# Altium schematic sheet DisplayPort_CON.SchDoc
size 420 x 297 mm; SheetNumber: 4; SheetTotal: 11; ModifiedBy: -; CheckedDate: -; Title2: Title 2; DivGrp: WUT ISE; Designer: G.Kasprowicz
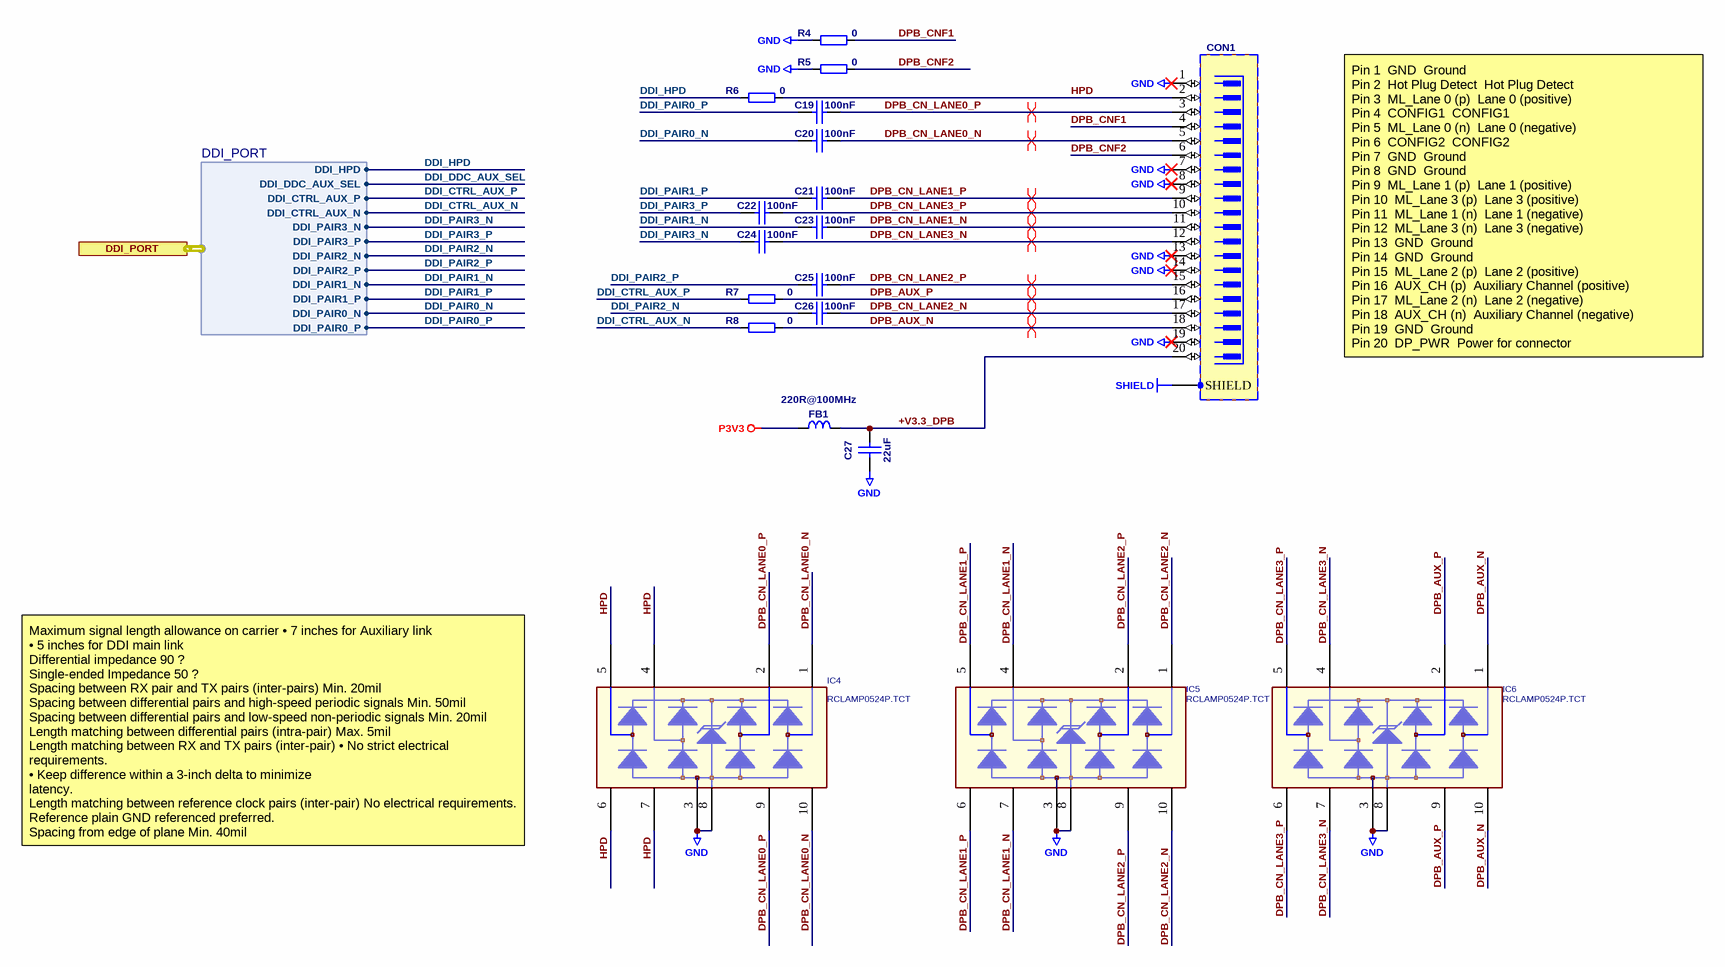
[diagram p0: DisplayPort_CON.SchDoc]

## Parts
C19  100nF  [CAPC1005X55N]
C20  100nF  [CAPC1005X55N]
C21  100nF  [CAPC1005X55N]
C22  100nF  [CAPC1005X55N]
C23  100nF  [CAPC1005X55N]
C24  100nF  [CAPC1005X55N]
C25  100nF  [CAPC1005X55N]
C26  100nF  [CAPC1005X55N]
C27  22uF  [CAPC2012X135N]
CON1  Mini DP  [MULTICOMP_64L020S-3x1N-B]  (value not drawn)
FB1  220R@100MHz  [0603L]
IC4  RCLAMP0524P.TCT  [SMDARRAYC_10P4C]
IC5  RCLAMP0524P.TCT  [SMDARRAYC_10P4C]
IC6  RCLAMP0524P.TCT  [SMDARRAYC_10P4C]
R4  0  [RESC1005X40N]
R5  0  [RESC1005X40N]
R6  0  [RESC1005X40N]
R7  0  [RESC1005X40N]
R8  0  [RESC1005X40N]

## Ports
DDI_PORT (harness DDI_PORT)

## Harnesses
DDI_PORT: DDI_PAIR0_P, DDI_PAIR0_N, DDI_PAIR1_P, DDI_PAIR1_N, DDI_PAIR2_P, DDI_PAIR2_N, DDI_CTRL_AUX_N, DDI_CTRL_AUX_P, DDI_DDC_AUX_SEL, DDI_HPD, DDI_PAIR3_P, DDI_PAIR3_N

## Nets
GND: C27.1 CON1.1 CON1.7 CON1.8 CON1.13 CON1.14 CON1.19 IC4.3 IC4.8 IC5.3 IC5.8 IC6.3 IC6.8 R4.1 R5.1
P3V3: FB1.1
SHIELD: CON1.SHIELD
+V3.3_DPB: C27.2 CON1.20 FB1.2
DDI_CTRL_AUX_N: R8.1 ; port DDI_PORT.DDI_CTRL_AUX_N
DDI_CTRL_AUX_P: R7.1 ; port DDI_PORT.DDI_CTRL_AUX_P
DDI_DDC_AUX_SEL: port DDI_PORT.DDI_DDC_AUX_SEL
DDI_HPD: R6.1 ; port DDI_PORT.DDI_HPD
DDI_PAIR0_N: C20.1 ; port DDI_PORT.DDI_PAIR0_N
DDI_PAIR0_P: C19.1 ; port DDI_PORT.DDI_PAIR0_P
DDI_PAIR1_N: C23.1 ; port DDI_PORT.DDI_PAIR1_N
DDI_PAIR1_P: C21.1 ; port DDI_PORT.DDI_PAIR1_P
DDI_PAIR2_N: C26.1 ; port DDI_PORT.DDI_PAIR2_N
DDI_PAIR2_P: C25.1 ; port DDI_PORT.DDI_PAIR2_P
DDI_PAIR3_N: C24.1 ; port DDI_PORT.DDI_PAIR3_N
DDI_PAIR3_P: C22.1 ; port DDI_PORT.DDI_PAIR3_P
DPB_AUX_N: CON1.18 IC6.1 IC6.10 R8.2
DPB_AUX_P: CON1.16 IC6.2 IC6.9 R7.2
DPB_CN_LANE0_N: C20.2 CON1.5 IC4.1 IC4.10
DPB_CN_LANE0_P: C19.2 CON1.3 IC4.2 IC4.9
DPB_CN_LANE1_N: C23.2 CON1.11 IC5.4 IC5.7
DPB_CN_LANE1_P: C21.2 CON1.9 IC5.5 IC5.6
DPB_CN_LANE2_N: C26.2 CON1.17 IC5.1 IC5.10
DPB_CN_LANE2_P: C25.2 CON1.15 IC5.2 IC5.9
DPB_CN_LANE3_N: C24.2 CON1.12 IC6.4 IC6.7
DPB_CN_LANE3_P: C22.2 CON1.10 IC6.5 IC6.6
DPB_CNF1: CON1.4 R4.2
DPB_CNF2: CON1.6 R5.2
HPD: CON1.2 IC4.4 IC4.5 IC4.6 IC4.7 R6.2

## Layout directives
differential pair: DPB_AUX_N, DPB_AUX_P, DPB_CN_LANE0_N, DPB_CN_LANE0_P, DPB_CN_LANE1_N, DPB_CN_LANE1_P, DPB_CN_LANE2_N, DPB_CN_LANE2_P, DPB_CN_LANE3_N, DPB_CN_LANE3_P

## Notes on the sheet
- Pin 1 	GND 	Ground
  Pin 2 	Hot Plug Detect 	Hot Plug Detect
  Pin 3 	ML_Lane 0 (p) 	Lane 0 (positive)
  Pin 4 	CONFIG1 	CONFIG1
  Pin 5 	ML_Lane 0 (n) 	Lane 0 (negative)
  Pin 6 	CONFIG2 	CONFIG2
  Pin 7 	GND 	Ground
  Pin 8 	GND 	Ground
  Pin 9 	ML_Lane 1 (p) 	Lane 1 (positive)
  Pin 10 	ML_Lane 3 (p) 	Lane 3 (positive)
  Pin 11 	ML_Lane 1 (n) 	Lane 1 (negative)
  Pin 12 	ML_Lane 3 (n) 	Lane 3 (negative)
  Pin 13 	GND 	Ground
  Pin 14 	GND 	Ground
  Pin 15 	ML_Lane 2 (p) 	Lane 2 (positive)
  Pin 16 	AUX_CH (p) 	Auxiliary Channel (positive)
  Pin 17 	ML_Lane 2 (n) 	Lane 2 (negative)
  Pin 18 	AUX_CH (n) 	Auxiliary Channel (negative)
  Pin 19 	GND 	Ground
  Pin 20 	DP_PWR 	Power for connector
- Maximum signal length allowance on carrier • 7 inches for Auxiliary link
  • 5 inches for DDI main link
  Differential impedance 90 ?
  Single-ended Impedance 50 ?
  Spacing between RX pair and TX pairs (inter-pairs) Min. 20mil
  Spacing between differential pairs and high-speed periodic signals Min. 50mil
  Spacing between differential pairs and low-speed non-periodic signals Min. 20mil
  Length matching between differential pairs (intra-pair) Max. 5mil
  Length matching between RX and TX pairs (inter-pair) • No strict electrical requirements.
  • Keep difference within a 3-inch delta to minimize
  latency.
  Length matching between reference clock pairs (inter-pair) No electrical requirements.
  Reference plain GND referenced preferred.
  Spacing from edge of plane Min. 40mil
- Project/Equipment
- Document
- Designer
- Drawn by
- Check.by
- Copyright WUT ISE 2024.
  This documentation describes Open Hardware and is licensed under the CERN OHL v.2. You may redistribute and modify this documentation under the terms of the CERN OHL v.2. (http://ohwr.org/CERNOHL). This documentation is distributed WITHOUT ANY EXPRESS OR IMPLIED WARRANTY, INCLUDING OF MERCHANTABILITY, SATISFACTORY QUALITY AND FITNESS FOR A PARTICULAR PURPOSE. Please see the CERN OHL v.2 for applicable conditions.
- Contact
- File
- Last Mod.
- Print Date
- Sheet
- Size
- A3
- of
- Rev

## Library data of the parts
C19-C26 = CC0402_100NF_16V_10%_X7R: Non-polarised capacitor; Part Description: SMD Multilayer Chip Ceramic Capacitor; Manufacturer: GENERIC; Manufacturer1 Part Number: GRM155R71C104KA88D; Voltage: 16V; TC: X7R; Tolerance: ±10%; Part Number: CC0402_100NF_16V_10%_X7R; Component Kind: Standard; Component Type: Standard; Pin Count: 2; Value: 100nF; Status: Not Recommended; Manufacturer Part Number: CC0402_100NF_16V_10%_X7R; Case: 0402; Mounted: Yes; Socket: No; SMD: Yes; Sense: No; Manufacturer1 Example: MURATA; Manufacturer1 ComponentHeight: 0.55mm; HelpURL: \\cern.ch\dfs\Applications\Altium\Datasheets\CC0402_X7R_MURATA_GRM.pdf; Author: CERN DEM JLC; CreateDate: 05/12/2013; LatestRevisionDate: 03/12/2007
C27 = CC0805_22UF_16V_10%_X5R: Non-polarised capacitor; Manufacturer: GENERIC; Part Description: SMD Multilayer Chip Ceramic Capacitor; Manufacturer1 Part Number: C2012X5R1C226KT; Tolerance: ±10%; Voltage: 16V; TC: X5R; Manufacturer Part Number: CC0805_22UF_16V_10%_X5R; Part Number: CC0805_22UF_16V_10%_X5R; Value: 22uF; Component Kind: Standard; Component Type: Standard; Pin Count: 2; Status: Preferred; Case: 0805; Mounted: Yes; Socket: No; SMD: Yes; Sense: No; Manufacturer1 Example: TDK; Manufacturer1 ComponentHeight: 1.35mm; HelpURL: \\cern.ch\dfs\Applications\Altium\Datasheets\CC0805_X5R_TDK_C.pdf; Author: CERN DEM JLC; CreateDate: 25.10.2012; LatestRevisionDate: 25.10.2012
CON1 = MULTICOMP_64L020S-331N-B: Connector Mini DisplayPort 20 Male + 1 Shield; Part Description: Mini DisplayPort Receptacle, 20 Positions, Right Angled, Contact Plating 30u" Gold; Manufacturer: FREEPORT; Table: Miscellaneous; Part Number: MULTICOMP_64L020S-331N-B; Component Kind: Standard; Component Type: Standard; Pin Count: 21; Family: Mini DP; Mounted: Yes; Socket: No; SMD: Yes; Status: Not Recommended; Manufacturer Part Number: 64L020S-331N-B; ComponentHeight: 8.2mm; HelpURL: \\cern.ch\dfs\Applications\Altium\Datasheets\MULTICOMP_64L020S-3x1N-B.pdf; Author: CERN DEM JMW; CreateDate: 2012-07-16; LatestRevisionDate: 2012-09-24
FB1 = IND0805_MURATA_BLM21PG221SN1D: Inductor; Part Description: SMD EMIFIL Suppression Chip Bead Ferrite; Manufacturer: MURATA; Power: 2A; Resistance: 0.05R; Tolerance: ±25%; Table: Inductors SMD; Part Number: IND0805_MURATA_BLM21PG221SN1D; Component Kind: Standard; Component Type: Standard; Footprint: INDC2012X105N; Pin Count: 2; Value: 220R@100MHz; Status: None; Manufacturer Part Number: BLM21PG221SN1D; Case: 0805; Mounted: Yes; Socket: No; SMD: Yes; ComponentHeight: 1.05mm; HelpURL: \\cern.ch\dfs\Applications\Altium\Datasheets\IND0402_MURATA_BLM21P.pdf; Author: CERN DEM JLC; CreateDate: 2010-01-25; LatestRevisionDate: 2010-01-25
IC4-IC6 = D_TVS_RCLAMP0524P: DIODE,RCLAMP0524P,SEMTECH; Specification: SMD,ESD COMPONENT,ROHS
R4-R8 = R0402_0R_JUMPER: Resistor; Part Description: 1A (0.05R Max DC Resistance) Zero Ohm Jumper; Manufacturer: GENERIC; Manufacturer1 Part Number: 232270591001L; PressFit: No; Part Number: R0402_0R_JUMPER; Component Kind: Standard; Component Type: Standard; Pin Count: 2; Value: 0; Status: Not Recommended; Manufacturer Part Number: R0402_0R_JUMPER; Case: 0402; Mounted: Yes; Sense: No; Socket: No; SMD: Yes; Manufacturer1 Example: YAGEO PHYCOMP; Manufacturer1 ComponentHeight: 0.4mm; HelpURL: \\cern.ch\dfs\Applications\Altium\Datasheets\R0402_Phycomp_RC0402.pdf; Author: CERN DEM JLC; CreateDate: 03.12.2007; LatestRevisionDate: 17.10.2012